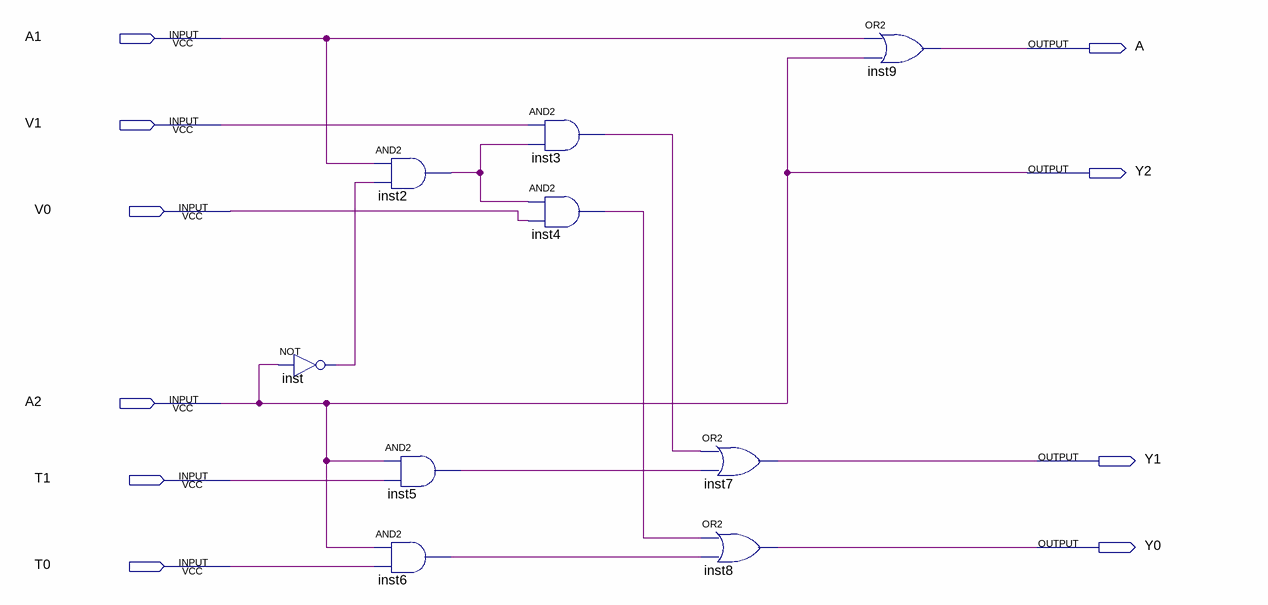
[diagram p0: schematic sheet]
// Quartus schematic q5.bdf as structural Verilog: 9 symbols, 10 pins
module q5 (
  input  A1,
  input  V1,
  input  V0,
  input  A2,
  input  T1,
  input  T0,
  output A,
  output Y2,
  output Y1,
  output Y0
);

  wire inst2_out, inst3_out, inst4_out, inst5_out, inst6_out, inst_out;

  not inst (inst_out, A2);
  and inst2 (inst2_out, A1, inst_out);
  and inst5 (inst5_out, A2, T1);
  and inst6 (inst6_out, A2, T0);
  and inst3 (inst3_out, V1, inst2_out);
  and inst4 (inst4_out, inst2_out, V0);
  or inst7 (Y1, inst3_out, inst5_out);
  or inst8 (Y0, inst4_out, inst6_out);
  or inst9 (A, A1, A2);

  assign Y2 = A2;
endmodule
